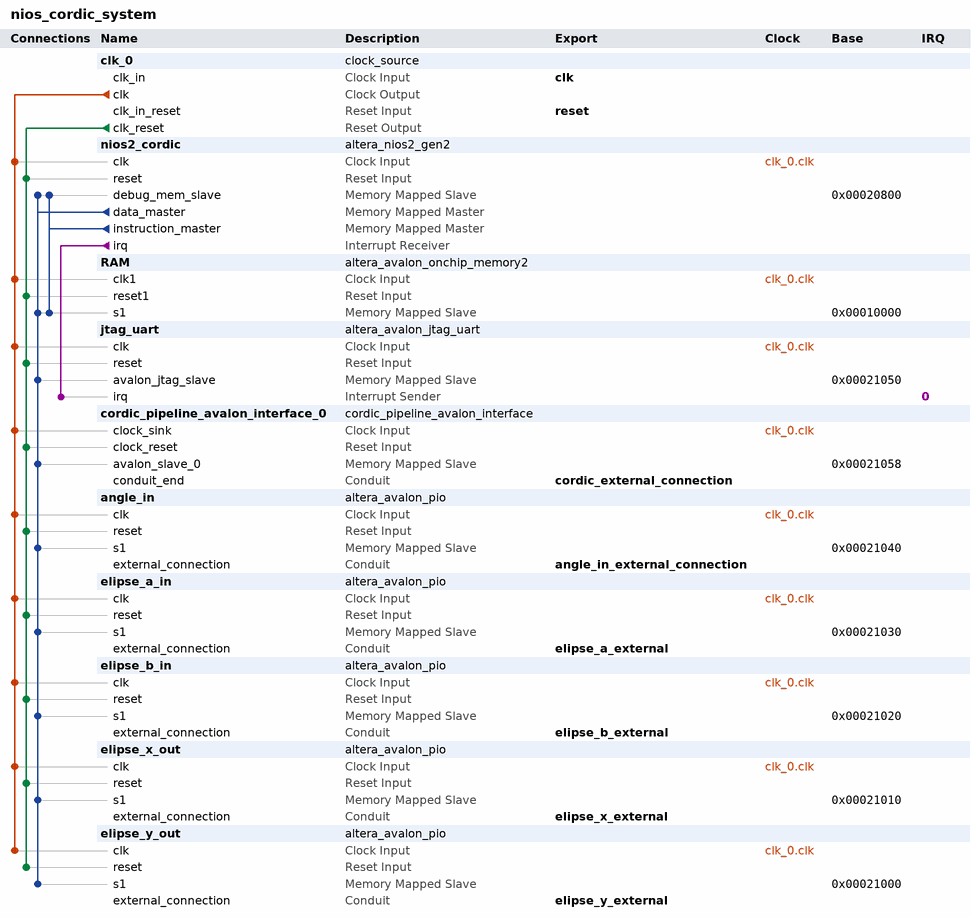
[diagram p0: system contents]
# Platform Designer (Qsys) system nios_cordic_system, MAX 10 10M50DAF484C6GES
# Parameters at their usual value, and those the tool derives, are not listed.
package require -exact qsys 19.1
create_system nios_cordic_system
set_project_property DEVICE_FAMILY {MAX 10}
set_project_property DEVICE 10M50DAF484C6GES

add_instance clk_0 clock_source 19.1
set_instance_parameter_value clk_0 clockFrequency 50000000

add_instance nios2_cordic altera_nios2_gen2 19.1
set_instance_parameter_value nios2_cordic dcache_size 2048
set_instance_parameter_value nios2_cordic exceptionSlave RAM.s1
set_instance_parameter_value nios2_cordic icache_size 4096
set_instance_parameter_value nios2_cordic impl Tiny
set_instance_parameter_value nios2_cordic resetSlave RAM.s1

add_instance RAM altera_avalon_onchip_memory2 19.1
set_instance_parameter_value RAM dataWidth 32
set_instance_parameter_value RAM dualPort false
set_instance_parameter_value RAM initMemContent true
set_instance_parameter_value RAM initializationFileName /media/piko/SeagateBackupPlusDrive/intelFPGA_lite/19.1/AGH-FPGA-labs/cordic_lab/software/Application_Cordic/mem_init/nios_cordic_system_RAM.hex
set_instance_parameter_value RAM memorySize 40960
set_instance_parameter_value RAM useNonDefaultInitFile true

add_instance jtag_uart altera_avalon_jtag_uart 19.1
set_instance_parameter_value jtag_uart simInteractiveOptions NO_INTERACTIVE_WINDOWS

add_instance cordic_pipeline_avalon_interface_0 cordic_pipeline_avalon_interface 1.0

add_instance angle_in altera_avalon_pio 19.1
set_instance_parameter_value angle_in direction Input
set_instance_parameter_value angle_in width 12

add_instance elipse_a_in altera_avalon_pio 19.1
set_instance_parameter_value elipse_a_in direction Input
set_instance_parameter_value elipse_a_in width 32

add_instance elipse_b_in altera_avalon_pio 19.1
set_instance_parameter_value elipse_b_in direction Input
set_instance_parameter_value elipse_b_in width 32

add_instance elipse_x_out altera_avalon_pio 19.1
set_instance_parameter_value elipse_x_out direction Output
set_instance_parameter_value elipse_x_out width 32

add_instance elipse_y_out altera_avalon_pio 19.1
set_instance_parameter_value elipse_y_out direction Output
set_instance_parameter_value elipse_y_out width 32

# connections
add_connection clk_0.clk angle_in.clk clock
add_connection clk_0.clk cordic_pipeline_avalon_interface_0.clock_sink clock
add_connection clk_0.clk elipse_a_in.clk clock
add_connection clk_0.clk elipse_b_in.clk clock
add_connection clk_0.clk elipse_x_out.clk clock
add_connection clk_0.clk elipse_y_out.clk clock
add_connection clk_0.clk jtag_uart.clk clock
add_connection clk_0.clk nios2_cordic.clk clock
add_connection clk_0.clk RAM.clk1 clock
add_connection clk_0.clk_reset angle_in.reset reset
add_connection clk_0.clk_reset cordic_pipeline_avalon_interface_0.clock_reset reset
add_connection clk_0.clk_reset elipse_a_in.reset reset
add_connection clk_0.clk_reset elipse_b_in.reset reset
add_connection clk_0.clk_reset elipse_x_out.reset reset
add_connection clk_0.clk_reset elipse_y_out.reset reset
add_connection clk_0.clk_reset jtag_uart.reset reset
add_connection clk_0.clk_reset nios2_cordic.reset reset
add_connection clk_0.clk_reset RAM.reset1 reset
add_connection nios2_cordic.data_master angle_in.s1 avalon
set_connection_parameter_value nios2_cordic.data_master/angle_in.s1 baseAddress 0x00021040
add_connection nios2_cordic.data_master cordic_pipeline_avalon_interface_0.avalon_slave_0 avalon
set_connection_parameter_value nios2_cordic.data_master/cordic_pipeline_avalon_interface_0.avalon_slave_0 baseAddress 0x00021058
add_connection nios2_cordic.data_master elipse_a_in.s1 avalon
set_connection_parameter_value nios2_cordic.data_master/elipse_a_in.s1 baseAddress 0x00021030
add_connection nios2_cordic.data_master elipse_b_in.s1 avalon
set_connection_parameter_value nios2_cordic.data_master/elipse_b_in.s1 baseAddress 0x00021020
add_connection nios2_cordic.data_master elipse_x_out.s1 avalon
set_connection_parameter_value nios2_cordic.data_master/elipse_x_out.s1 baseAddress 0x00021010
add_connection nios2_cordic.data_master elipse_y_out.s1 avalon
set_connection_parameter_value nios2_cordic.data_master/elipse_y_out.s1 baseAddress 0x00021000
add_connection nios2_cordic.data_master jtag_uart.avalon_jtag_slave avalon
set_connection_parameter_value nios2_cordic.data_master/jtag_uart.avalon_jtag_slave baseAddress 0x00021050
add_connection nios2_cordic.data_master nios2_cordic.debug_mem_slave avalon
set_connection_parameter_value nios2_cordic.data_master/nios2_cordic.debug_mem_slave baseAddress 0x00020800
add_connection nios2_cordic.data_master RAM.s1 avalon
set_connection_parameter_value nios2_cordic.data_master/RAM.s1 baseAddress 0x00010000
add_connection nios2_cordic.instruction_master nios2_cordic.debug_mem_slave avalon
set_connection_parameter_value nios2_cordic.instruction_master/nios2_cordic.debug_mem_slave baseAddress 0x00020800
add_connection nios2_cordic.instruction_master RAM.s1 avalon
set_connection_parameter_value nios2_cordic.instruction_master/RAM.s1 baseAddress 0x00010000
add_connection nios2_cordic.irq jtag_uart.irq interrupt
set_connection_parameter_value nios2_cordic.irq/jtag_uart.irq irqNumber 0

# exported interfaces
add_interface angle_in_external_connection conduit end
set_interface_property angle_in_external_connection EXPORT_OF angle_in.external_connection
add_interface clk clock sink
set_interface_property clk EXPORT_OF clk_0.clk_in
add_interface cordic_external_connection conduit end
set_interface_property cordic_external_connection EXPORT_OF cordic_pipeline_avalon_interface_0.conduit_end
add_interface elipse_a_external conduit end
set_interface_property elipse_a_external EXPORT_OF elipse_a_in.external_connection
add_interface elipse_b_external conduit end
set_interface_property elipse_b_external EXPORT_OF elipse_b_in.external_connection
add_interface elipse_x_external conduit end
set_interface_property elipse_x_external EXPORT_OF elipse_x_out.external_connection
add_interface elipse_y_external conduit end
set_interface_property elipse_y_external EXPORT_OF elipse_y_out.external_connection
add_interface reset reset sink
set_interface_property reset EXPORT_OF clk_0.clk_in_reset

set_interconnect_requirement {$system} qsys_mm.clockCrossingAdapter HANDSHAKE
set_interconnect_requirement {$system} qsys_mm.enableEccProtection FALSE
set_interconnect_requirement {$system} qsys_mm.insertDefaultSlave FALSE
set_interconnect_requirement {$system} qsys_mm.maxAdditionalLatency 1

save_system nios_cordic_system.qsys
